# Altium schematic sheet amplifier.SchDoc
size A
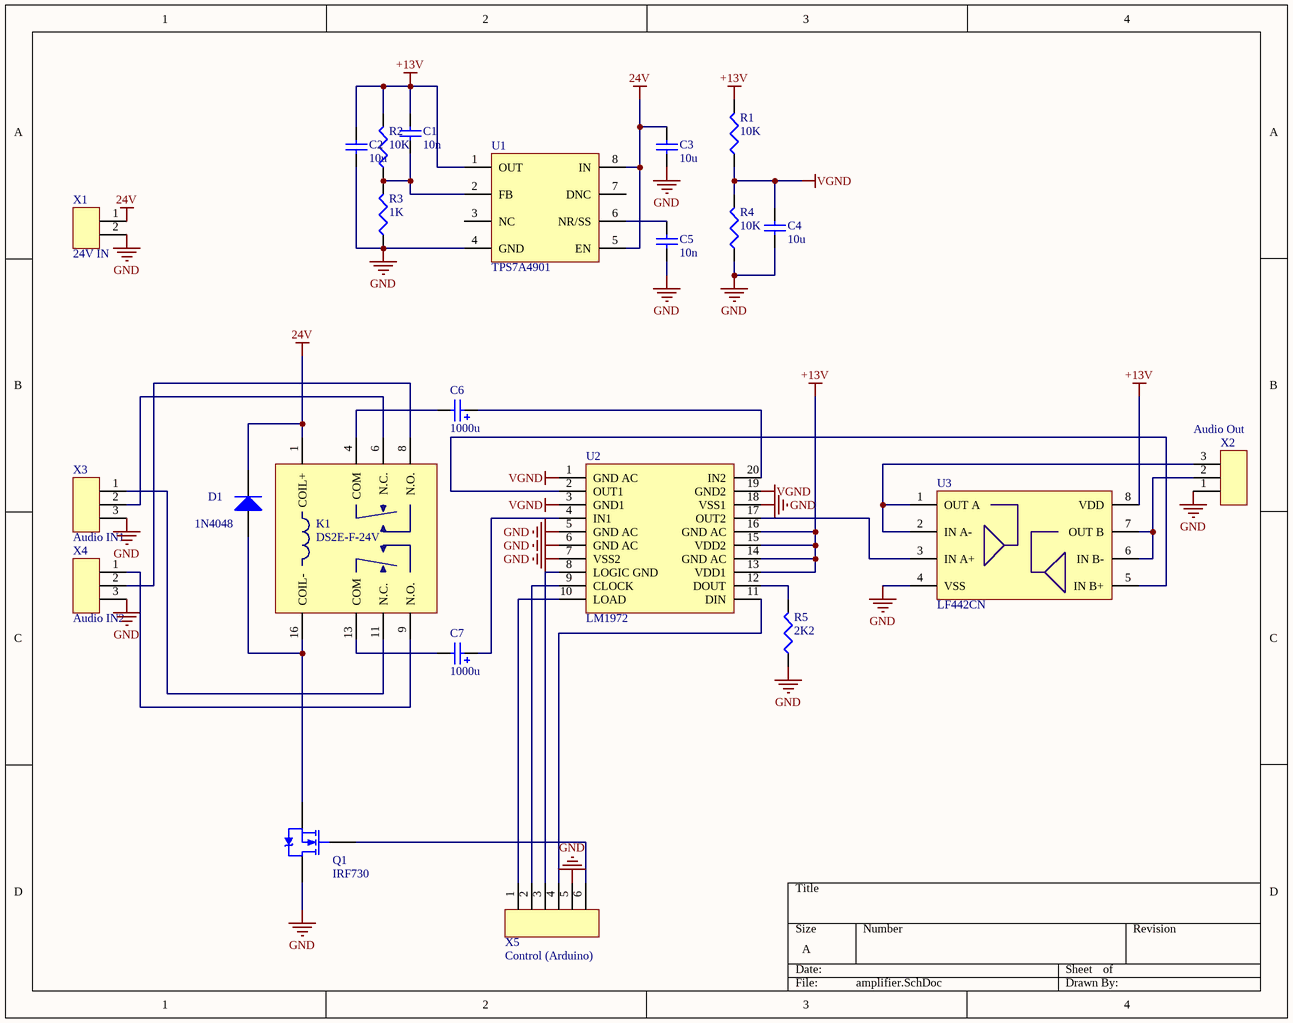
[diagram p0: amplifier.SchDoc]

## Parts
C1  10n  [CAPC3216X17N]
C2  10u  [CAPC3216X17N]
C3  10u  [CAPC3216X17N]
C4  10u  [CAPC3216X17N]
C5  10n  [CAPC3216X17N]
C6  1000u  [Radial_0254_0381X0900]
C7  1000u  [Radial_0254_0381X0900]
D1  1N4048  [DO-35]
K1  DS2E-F-24V  [DS2E-F-DC24V]
Q1  IRF730  [TO-220AB]
R1  10K  [RESC2012X06M]
R2  10K  [RESC2012X06M]
R3  1K  [RESC3216X07N]
R4  10K  [RESC2012X06M]
R5  2K2  [RESC2012X06N]
U1  TPS7A4901  [MSOP-8]
U2  LM1972  [SOIC-20_0127_7.5mm]
U3  LF442CN  [DIP-08_0254_0762_0420]
X1  24V IN  [CON_1X02S_0254]
X2  Audio Out  [CON_1X03S_0254]
X3  Audio IN1  [CON_1X03S_0254]
X4  Audio IN2  [CON_1X03S_0254]
X5  Control (Arduino)  [CON_1X06S_0254]

## Nets
24V: C3.2 D1.2(K) K1.1(COIL+) U1.5(EN) U1.8(IN) X1.1
+13V: C1.2 C2.2 R1.2 R2.2 U1.1(OUT) U2.13(VDD1) U2.14(GND_AC) U2.15(VDD2) U2.16(GND_AC) U3.8(VDD)
GND: C2.1 C3.1 C4.1 C5.1 Q1.2(D) R3.1 R4.1 R5.1 U1.4(GND) U2.5(GND_AC) U2.6(GND_AC) U2.7(VSS2) U2.18(VSS1) U3.4(VSS) X1.2 X2.1 X3.3 X4.3 X5.5
VGND: C4.2 R1.1 R4.2 U2.1(GND_AC) U2.3(GND1) U2.19(GND2)
NetC1_1: C1.1 R2.1 R3.2 U1.2(FB)
NetC5_2: C5.2 U1.6(NR/SS)
NetC6_1: C6.1 U2.20(IN2)
NetC6_2: C6.2 K1.4(COM)
NetC7_1: C7.1 U2.4(IN1)
NetC7_2: C7.2 K1.13(COM)
NetD1_1: D1.1(A) K1.16(COIL-) Q1.3(S)
NetK1_6: K1.6(N.C.) X3.2
NetK1_8: K1.8(N.O.) X4.2
NetK1_9: K1.9(N.O.) X4.1
NetK1_11: K1.11(N.C.) X3.1
NetQ1_1: Q1.1(G) X5.6
NetR5_2: R5.2 U2.12(DOUT)
NetU2_2: U2.2(OUT1) U3.5(IN_B+)
NetU2_8: U2.8(LOGIC_GND) X5.3
NetU2_9: U2.9(CLOCK) X5.2
NetU2_10: U2.10(LOAD) X5.1
NetU2_11: U2.11(DIN) X5.4
NetU2_17: U2.17(OUT2) U3.3(IN_A+)
NetU3_1: U3.1(OUT_A) U3.2(IN_A-) X2.3
NetU3_6: U3.6(IN_B-) U3.7(OUT_B) X2.2

Not connected (* = marked no-connect by the designer): U1 3(NC) 7(DNC)

## Library data of the parts
C1 C5 = C1206C103K: CAP CER 10NF 50V 10% X7R 1206; Manufacturer: Yageo; Manufacturer Part Number: CC1206KRX7R9BB103; Capacitance: 10000pF; Value: 10n; Supplier 1: Digi-Key; RoHS: RoHS Compliant; Category: Capacitors; Stock 1: 405160; Pricing 1: 1=0.13, 10=0.092, 25=0.0688, 100=0.0436, 250=0.03672, 500=0.03076, 1000=0.02525 (USD); Packaging: Cut Tape (CT); Voltage - Rated: 50V; Tolerance: ±10%; Temperature Coefficient: X7R; Mounting Type: Surface Mount, MLCC; Operating Temperature: -55°C ~ 125°C; Applications: General Purpose; Ratings: -; Package / Case: 1206 (3216 Metric); Size / Dimension: 0.126" L x 0.063" W (3.20mm x 1.60mm); Height - Seated (Max): -; Thickness (Max): 0.033" (0.85mm); Lead Spacing: -; Features: -; Lead Style: -; ComponentLink1URL: http://www.yageo.com/documents/recent/UPY-GPHC_X7R_6.3V-to-50V_8.pdf; ComponentLink1Description: http://www.yageo.com/documents/recent/UPY-GPHC_X7R_6.3V-to-50V_8.pdf; Supplier Part Number 1: 311-1174-1-ND
C2-C4 = C1206C104K: CAP CER 100NF 50V 10% X7R 1206; Manufacturer: Kemet; Manufacturer Part Number: C1206C104K5RACTU; Capacitance: 0.1µF; Value: 10u; Supplier 1: Digi-Key; RoHS: RoHS Compliant; Category: Capacitors; Stock 1: 620114; Pricing 1: 1=0.1, 10=0.072, 50=0.039, 100=0.033, 250=0.027, 500=0.0231, 1000=0.018 (USD); Packaging: Cut Tape (CT); Voltage - Rated: 50V; Tolerance: ±10%; Temperature Coefficient: X7R; Mounting Type: Surface Mount, MLCC; Operating Temperature: -55°C ~ 125°C; Applications: General Purpose; Ratings: -; Package / Case: 1206 (3216 Metric); Size / Dimension: 0.126" L x 0.063" W (3.20mm x 1.60mm); Height - Seated (Max): -; Thickness (Max): 0.035" (0.88mm); Lead Spacing: -; Features: -; Lead Style: -; ComponentLink1URL: http://www.kemet.com/datasheets&C1206C104K5RACTU; ComponentLink1Description: http://www.kemet.com/datasheets&C1206C104K5RACTU
C6 C7 = CA-1CM102: CAP ALUM 1000UF 16V 20% RADIAL; Manufacturer: Panasonic Electronic Components; Manufacturer Part Number: ECA-1CM102B; Capacitance: 1000µF; Lifetime @ Temp.: 2000 Hrs @ 85°C; Ripple Current: 680mA; Value: 1000u; Supplier 1: Digi-Key; RoHS: RoHS Compliant; Category: Capacitors; Stock 1: 118500; Pricing 1: 500=0.1596, 1000=0.13566, 5000=0.1197, 10000=0.11172, 25000=0.10773 (USD); Packaging: Tape & Box (TB); Voltage Rating: 16V; Tolerance: ±20%; ESR (Equivalent Series Resistance): -; Operating Temperature: -40°C ~ 85°C; Type: -; Applications: General Purpose; Impedance: -; Lead Spacing: 0.197" (5.00mm); Size / Dimension: 0.394" Dia (10.00mm); Height - Seated (Max): 0.669" (17.00mm); Surface Mount Land Size: -; Mounting Type: Through Hole; Package / Case: Radial, Can; ComponentLink1URL: http://industrial.panasonic.com/www-cgi/jvcr13pz.cgi?E+PZ+3+ABA0012+ECA1CM102B+7+WW; ComponentLink1Description: http://industrial.panasonic.com/www-cgi/jvcr13pz.cgi?E+PZ+3+ABA0012+ECA1CM102B+7+WW
D1 = 1N4048: 275 Amp Avg Power Silicon Rectifier Diode; Note: No PCB Footprint Available; Published: 8-Jun-2000; LatestRevisionDate: 17-Jul-2002; LatestRevisionNote: Re-released for DXP Platform.; DatasheetVersion: PD-2.091; PackageReference: DO-205AB; Publisher: Altium Limited; ComponentLink1Description: Manufacturer Link; ComponentLink1URL: http://www.irf.com/; ComponentLink2Description: Datasheet; ComponentLink2URL: http://www.irf.com/product-info/datasheets/data/1n4044.pdf
K1 = DS2E-F-DC24V: Relay 24V; Manufacturer: Panasonic Electric Works; Manufacturer Part Number: DS2E-S-DC24V; Relay Type: General Purpose; Coil Type: Non Latching; Coil Current: 8.3mA; Coil Voltage: 24VDC; Contact Form: DPDT (2 Form C); Contact Rating (Current): 2A; Switching Voltage: 250VAC, 220VDC - Max; Turn On Voltage (Max): 16.8 VDC; Turn Off Voltage (Min): 2.4 VDC; Operate Time: 10ms; Release Time: 5ms; Coil Power: 200 mW; Coil Resistance: 2.88 kOhms; Supplier 1: Digi-Key; Supplier 2: Digi-Key; RoHS: RoHS Compliant; Category: Relays; Stock 2: 3240; Pricing 2: 1=5.37, 25=4.9276, 50=4.38, 100=3.723, 500=3.285, 1000=3.1755, 5000=3.066, 10000=2.9127, 25000=2.847 (USD); Packaging: Tube; Features: Sealed - Amber; Mounting Type: Through Hole; Termination Style: PC Pin; Contact Material: Silver (Ag), Gold (Au); Operating Temperature: -40°C ~ 70°C; ComponentLink1URL: http://pewa.panasonic.com/assets/pcsd/catalog/ds-catalog.pdf; ComponentLink1Description: http://pewa.panasonic.com/assets/pcsd/catalog/ds-catalog.pdf
Q1 = IRF730: HEXFET N-Channel Power MOSFET; Note: Pin 2 is electrically connected to pin 4.; Published: 8-Jun-2000; LatestRevisionDate: 17-Jul-2002; LatestRevisionNote: Re-released for DXP Platform.; DatasheetVersion: PD-9.308K; PackageVersion: Feb-1997; PackageReference: TO-220AB; Publisher: Altium Limited; PackageDescription: TO, Thru-Hole, Vertical, Heatsink Mounted; 3 In-Line Leads; Pitch 2.54 mm; ComponentLink1Description: Manufacturer Link; ComponentLink1URL: http://www.irf.com/; ComponentLink2Description: Datasheet; ComponentLink2URL: http://www.irf.com/product-info/datasheets/data/irf730.pdf
R1 R2 R4 = RC0805FR-0710KL: RES 10K OHM 1/8W 1% 0805 SMD; Manufacturer: Yageo; Power (Watts): 0.125W, 1/8W; Temperature Coefficient: ±100ppm/°C; Value: 10K; Supplier 1: Digi-Key; Manufacturer Part Number: RC0805FR-0710KL; RoHS: RoHS Compliant; Category: Resistors; Stock 1: 3054580; Pricing 1: 1=0.1, 10=0.019, 25=0.0148, 100=0.0089, 250=0.00764, 500=0.0054, 1000=0.00381, 2500=0.0033 (USD); Packaging: Digi-Reel®; Resistance (Ohms): 10k; Tolerance: ±1%; Composition: Thick Film; Features: -; Package / Case: 0805 (2012 Metric); Supplier Device Package: 0805; Size / Dimension: 0.079" L x 0.049" W (2.00mm x 1.25mm); Height: 0.024" (0.60mm); Number of Terminations: 2; ComponentLink1URL: http://media.digikey.com/pdf/Data%20Sheets/Yageo%20PDFs/RC0805%20Pb%20Free.pdf; ComponentLink1Description: http://media.digikey.com/pdf/Data%20Sheets/Yageo%20PDFs/RC0805%20Pb%20Free.pdf
R3 = RC1206FR-071KL: RES 1.00K OHM 1/4W 1% 1206 SMD; Manufacturer: Yageo; Power (Watts): 0.25W, 1/4W; Temperature Coefficient: ±100ppm/°C; Value: 1K; Supplier 1: Digi-Key; Manufacturer Part Number: RC1206FR-071KL; RoHS: RoHS Compliant; Category: Resistors; Stock 1: 459682; Pricing 1: 1=0.1, 10=0.03, 25=0.0228, 100=0.0139, 250=0.01196, 500=0.00846, 1000=0.00597, 2500=0.00518 (USD); Packaging: Cut Tape (CT); Resistance (Ohms): 1k; Tolerance: ±1%; Composition: Thick Film; Features: -; Package / Case: 1206 (3216 Metric); Supplier Device Package: 1206; Size / Dimension: 0.122" L x 0.063" W (3.10mm x 1.60mm); Height: 0.026" (0.65mm); Number of Terminations: 2; ComponentLink1URL: http://www.yageo.com/documents/recent/PYu-RC1206_51_RoHS_L-4.pdf; ComponentLink1Description: http://www.yageo.com/documents/recent/PYu-RC1206_51_RoHS_L-4.pdf; Supplier Part Number 1: 311-1.00KFRCT-ND
R5 = RC0805FR-072K2L: RES 2.20K OHM 1/8W 1% 0805 SMD; Manufacturer: Yageo; Resistance (Ohms): 2.2k; Power (Watts): 0.125W, 1/8W; Temperature Coefficient: ±100ppm/°C; Value: 2K2; Supplier 1: Digi-Key; Manufacturer Part Number: RC0805FR-072K2L; RoHS: RoHS Compliant; Category: Resistors; Stock 1: 328965; Pricing 1: 1=0.1, 10=0.019, 25=0.0148, 100=0.0089, 250=0.00764, 500=0.0054, 1000=0.00381, 2500=0.0033 (USD); Packaging: Digi-Reel®; Tolerance: ±1%; Composition: Thick Film; Features: -; Package / Case: 0805 (2012 Metric); Supplier Device Package: 0805; Size / Dimension: 0.079" L x 0.049" W (2.00mm x 1.25mm); Height: 0.024" (0.60mm); Number of Terminations: 2; ComponentLink1URL: http://media.digikey.com/pdf/Data%20Sheets/Yageo%20PDFs/RC0805%20Pb%20Free.pdf; ComponentLink1Description: http://media.digikey.com/pdf/Data%20Sheets/Yageo%20PDFs/RC0805%20Pb%20Free.pdf
U1 = TPS7A4901: IC, ADJ LDO REG, 1.2V-33V, 0.15A, MSOP-8; Manufacturer: Texas Instruments; Manufacturer Part Number: TPS7A4901DGNR; Regulator Topology: Positive Adjustable; Voltage - Output: 1.176 V ~ 33 V; Current - Output: 150mA; Voltage - Dropout (Typical): 0.333V @ 150mA; Number of Regulators: 1; Voltage - Input: 3 V ~ 35 V; Current - Limit (Min): 220mA; Supplier 1: Digi-Key; RoHS: RoHS Compliant; Category: Integrated Circuits (ICs); Stock 1: 7500; Pricing 1: 2500=1.2375 (USD); Packaging: Tape & Reel (TR); Operating Temperature: -40°C ~ 125°C; Mounting Type: Surface Mount; Package / Case: 8-TSSOP, 8-MSOP (0.118", 3.00mm Width) Exposed Pad; Supplier Device Package: 8-MSOP-PowerPad; ComponentLink1URL: http://www.ti.com/lit/ds/symlink/tps7a4901.pdf; ComponentLink1Description: http://www.ti.com/lit/ds/symlink/tps7a4901.pdf; Supplier Part Number 1: 296-27751-2-ND
U3 = LF442CN: LF442 Dual Low Power JFET Input Operational Amplifier; Manufacturer: TEXAS INSTRUMENTS; No. of Amplifiers: 2; Slew Rate: 1; Supply Voltage Range: 6V to 36; Amplifier Case Style: DIP; No. of Pins: 8; Amplifier Type: JFET Operational; Base Number: 442; IC Temperature Range: Commercial; Input Offset Voltage Max: 7.5; SVHC: No SVHC (16-Dec-2013); Supply Voltage + Nom: 15; Supply Voltage Max: 36; Supply Voltage Min: 10; Supplier 1: Farnell; Supplier 2: Farnell; Manufacturer Part Number: LF442CN; RoHS: YES; Stock 2: 445; Pricing 2: 1=1.24, 10=1.12, 100=1.06, 250=1.01, 500=0.98, 2000=0.336, 2000=0.332, 20000=0.328 (GBP); Op Amp Type: Low Power; Bandwidth: 1; Operating Temperature Min: 0; Operating Temperature Max: 70; Packaging: Each; Device Marking: LF442; IC Generic Number: 442; Logic Function Number: 442; MSL: MSL 1 - Unlimited; Operating Temperature Range: 0°C to +70; ComponentLink1URL: http://www.farnell.com/simulation/1745042.zip; ComponentLink1Description: http://www.farnell.com/simulation/1745042.zip; ComponentLink2URL: http://www.farnell.com/datasheets/78157.pdf; ComponentLink2Description: http://www.farnell.com/datasheets/78157.pdf; ComponentLink3URL: http://www.farnell.com/cad/1562079.zip; ComponentLink3Description: http://www.farnell.com/cad/1562079.zip; ComponentLink4URL: http://www.farnell.com/datasheets/1828886.pdf; ComponentLink4Description: http://www.farnell.com/datasheets/1828886.pdf
X1 = HDR1x02: Stecker 2-Pin; Manufacturer: Sullins Connector Solutions; Manufacturer Part Number: PREC040SFAN-RC; Connector Type: Header, Unshrouded; Number of Positions: 40; Number of Positions Loaded: All; Pitch: 0.100" (2.54mm); Supplier 1: Digi-Key; RoHS: RoHS Compliant; Category: Connectors, Interconnects; Stock 1: 1486; Pricing 1: 1=0.58, 10=0.518, 100=0.4263, 500=0.33698, 1000=0.28928, 5000=0.2639, 10000=0.25375 (USD); Packaging: Bulk; Contact Type: Male Pin; Number of Rows: 1; Row Spacing: -; Contact Mating Length: 0.318" (8.08mm); Mounting Type: Through Hole; Termination: Solder; Fastening Type: -; Features: -; Contact Finish: Tin; Contact Finish Thickness: -; Color: Black; ComponentLink1URL: http://media.digikey.com/PDF/Data%20Sheets/Sullins%20PDFs/xRxCzzzSxxN-RC_ST_11635-B.pdf; ComponentLink1Description: http://media.digikey.com/PDF/Data%20Sheets/Sullins%20PDFs/xRxCzzzSxxN-RC_ST_11635-B.pdf
X2-X4 = HDR1x03: Stecker 3-Pin; Manufacturer: Sullins Connector Solutions; Manufacturer Part Number: PREC040SFAN-RC; Connector Type: Header, Unshrouded; Number of Positions: 40; Number of Positions Loaded: All; Pitch: 0.100" (2.54mm); Supplier 1: Digi-Key; RoHS: RoHS Compliant; Category: Connectors, Interconnects; Stock 1: 1486; Pricing 1: 1=0.58, 10=0.518, 100=0.4263, 500=0.33698, 1000=0.28928, 5000=0.2639, 10000=0.25375 (USD); Packaging: Bulk; Contact Type: Male Pin; Number of Rows: 1; Row Spacing: -; Contact Mating Length: 0.318" (8.08mm); Mounting Type: Through Hole; Termination: Solder; Fastening Type: -; Features: -; Contact Finish: Tin; Contact Finish Thickness: -; Color: Black; ComponentLink1URL: http://media.digikey.com/PDF/Data%20Sheets/Sullins%20PDFs/xRxCzzzSxxN-RC_ST_11635-B.pdf; ComponentLink1Description: http://media.digikey.com/PDF/Data%20Sheets/Sullins%20PDFs/xRxCzzzSxxN-RC_ST_11635-B.pdf
X5 = HDR1x06: Stecker 4-Pin; Manufacturer: Sullins Connector Solutions; Manufacturer Part Number: PREC040SFAN-RC; Connector Type: Header, Unshrouded; Number of Positions: 40; Number of Positions Loaded: All; Pitch: 0.100" (2.54mm); Supplier 1: Digi-Key; RoHS: RoHS Compliant; Category: Connectors, Interconnects; Stock 1: 1486; Pricing 1: 1=0.58, 10=0.518, 100=0.4263, 500=0.33698, 1000=0.28928, 5000=0.2639, 10000=0.25375 (USD); Packaging: Bulk; Contact Type: Male Pin; Number of Rows: 1; Row Spacing: -; Contact Mating Length: 0.318" (8.08mm); Mounting Type: Through Hole; Termination: Solder; Fastening Type: -; Features: -; Contact Finish: Tin; Contact Finish Thickness: -; Color: Black; ComponentLink1URL: http://media.digikey.com/PDF/Data%20Sheets/Sullins%20PDFs/xRxCzzzSxxN-RC_ST_11635-B.pdf; ComponentLink1Description: http://media.digikey.com/PDF/Data%20Sheets/Sullins%20PDFs/xRxCzzzSxxN-RC_ST_11635-B.pdf
U2 = LM1972: Supplier 1: Digi-Key